# EAGLE design PIC32-RETROBSD_Rev_C (EAGLE 4.16)
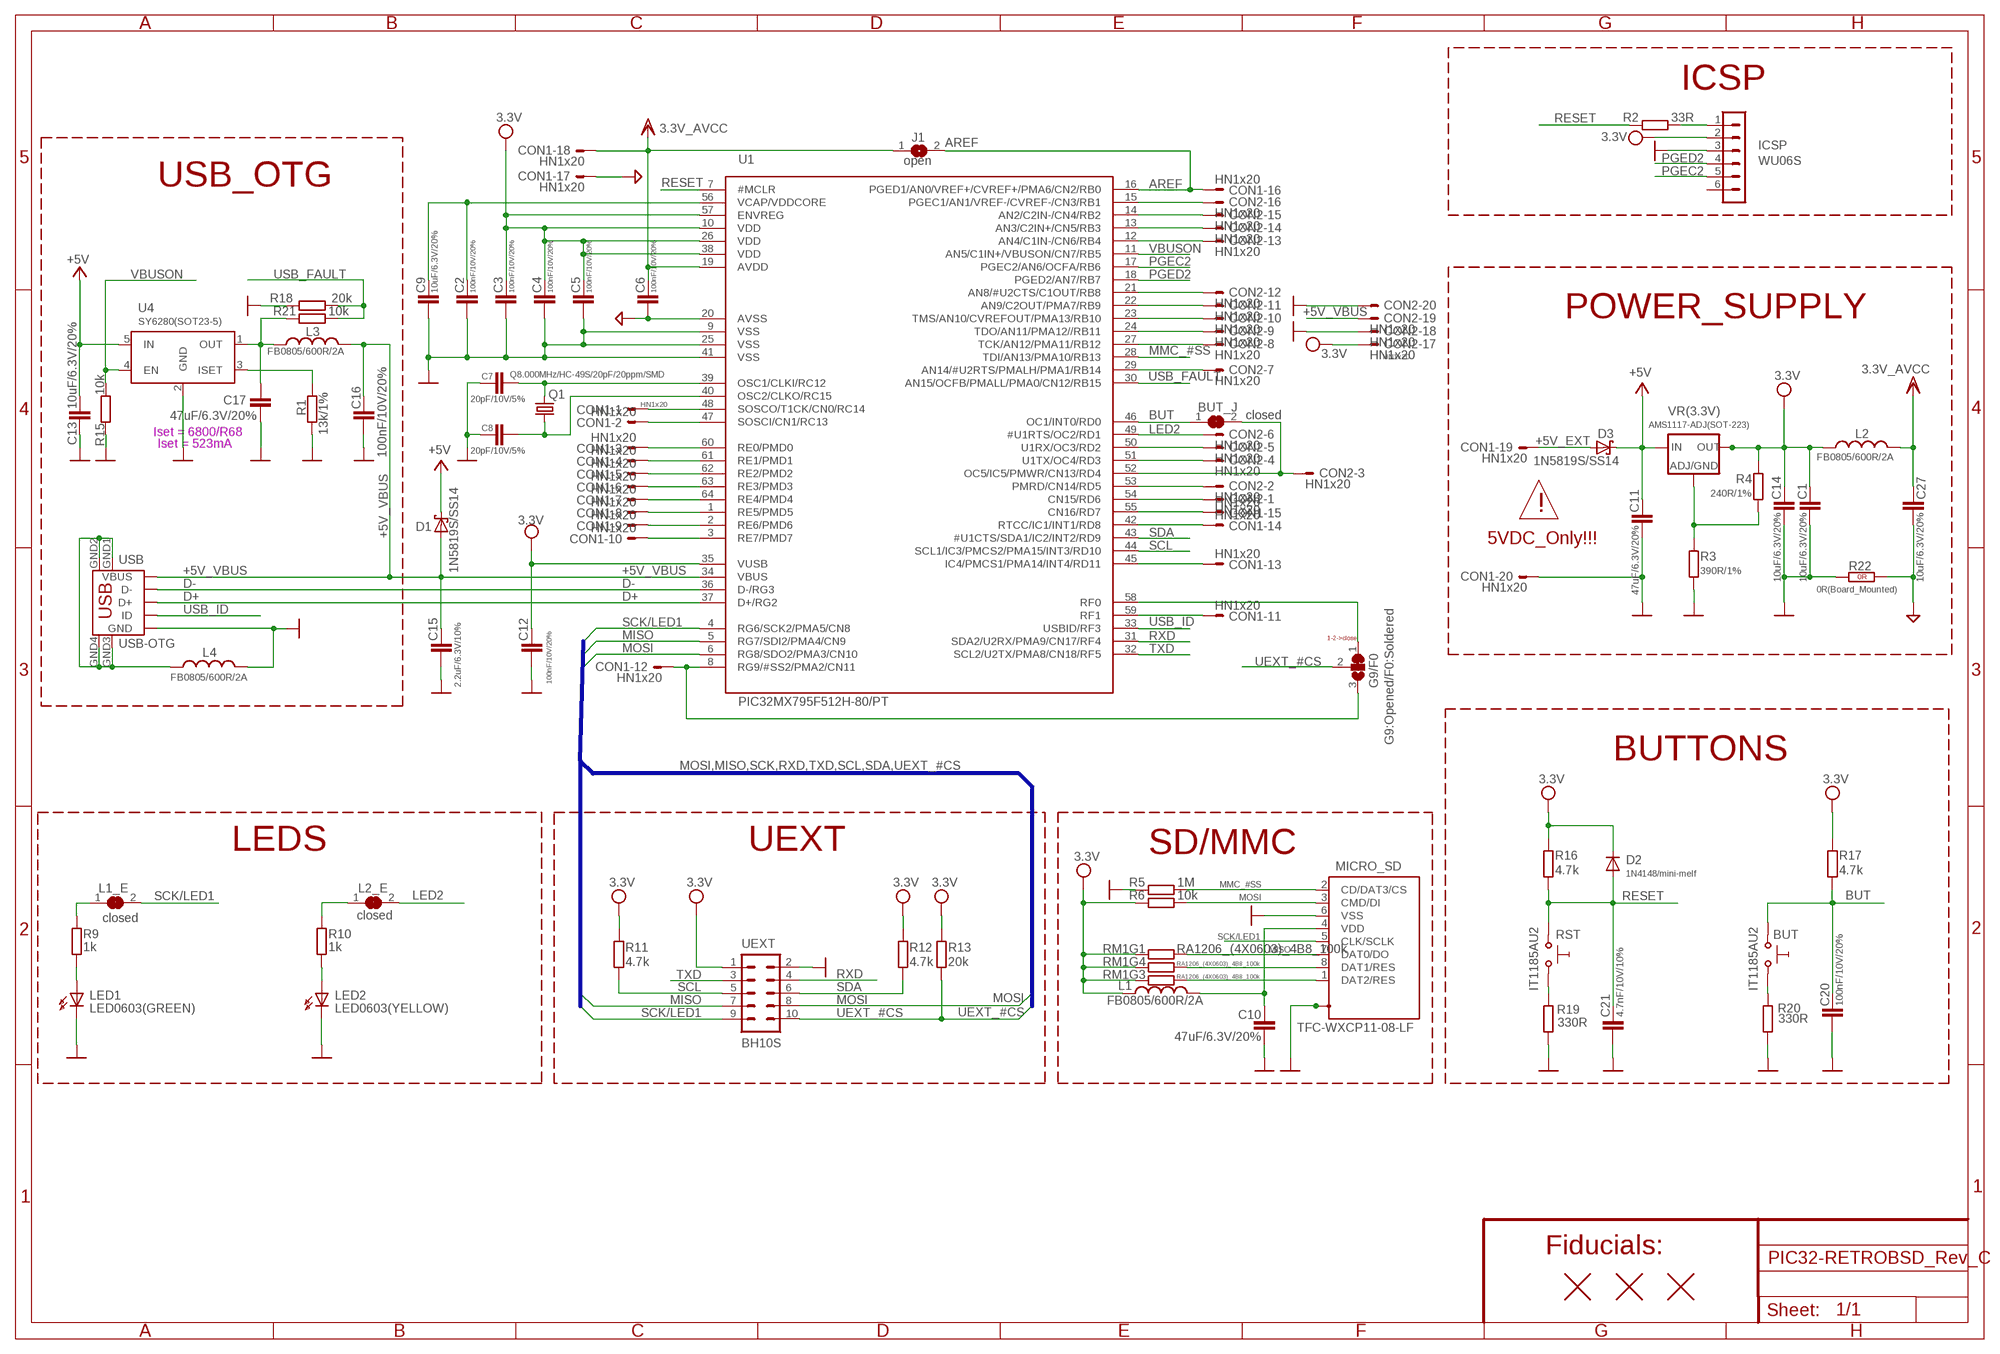
[diagram p0: schematic, sheet 1]

## Parts
BUT  IT1185AU2  SW-TAKTIT1185AU2  [IT1185AU2]
BUT_J  closed  SJSJ_1_SMALLER_CLOSE  [SJ_1_SMALLER_CLOSE]
C1  10uF/6.3V/20%  C-EUC0603_DWS  [C0603_DWS]
C2  100nF/10V/20%  C-EUC0603_DWS  [C0603_DWS]
C3  100nF/10V/20%  C-EUC0603_DWS  [C0603_DWS]
C4  100nF/10V/20%  C-EUC0603_DWS  [C0603_DWS]
C5  100nF/10V/20%  C-EUC0603_DWS  [C0603_DWS]
C6  100nF/10V/20%  C-EUC0603_DWS  [C0603_DWS]
C7  20pF/10V/5%  C-EUC0603_DWS  [C0603_DWS]
C8  20pF/10V/5%  C-EUC0603_DWS  [C0603_DWS]
C9  10uF/6.3V/20%  C-EUC0603_DWS  [C0603_DWS]
C10  47uF/6.3V/20%  C-EUC0805_5MIL_DWS  [C0805_5MIL_DWS]
C11  47uF/6.3V/20%  C-EUC0805_5MIL_DWS  [C0805_5MIL_DWS]
C12  100nF/10V/20%  C-EUC0603_DWS  [C0603_DWS]
C13  10uF/6.3V/20%  C-EUC0603_DWS  [C0603_DWS]
C14  10uF/6.3V/20%  C-EUC0603_DWS  [C0603_DWS]
C15  2.2uF/6.3V/10%  C-EUC0603_DWS  [C0603_DWS]
C16  100nF/10V/20%  C-EUC0603_DWS  [C0603_DWS]
C17  47uF/6.3V/20%  C-EUC0805_5MIL_DWS  [C0805_5MIL_DWS]
C20  100nF/10V/20%  C-EUC0603_DWS  [C0603_DWS]
C21  4.7nF/10V/10%  C-EUC0603_5MIL  [C0603_5MIL]
C27  10uF/6.3V/20%  C-EUC0603_DWS  [C0603_DWS]
CON1  HN1x20  CON20X1_2  [CON20X1]
CON2  HN1x20  CON20X1_2  [CON20X1]
D1  1N5819S/SS14  SCHOTKKY7.62SS2  [MLL-41]
D2  1N4148/mini-melf  DSMD  [MINI-MELF]
D3  1N5819S/SS14  SCHOTKKY7.62SS2  [MLL-41]
G9/F0  G9:Opened/F0:Soldered  SJ2W3  [SJ_2_SMALL]
ICSP  WU06S  CON6WUO6S  [WU06S]
J1  open  SJSJ_SMALLER  [SJ_1_SMALLER]
L1  FB0805/600R/2A  L-USL0805_5MIL_DWS  [L0805_5MIL_DWS]
L1_E  closed  SJSJ_1_SMALLER_CLOSE  [SJ_1_SMALLER_CLOSE]
L2  FB0805/600R/2A  L-USL0805_5MIL_DWS  [L0805_5MIL_DWS]
L2_E  closed  SJSJ_1_SMALLER_CLOSE  [SJ_1_SMALLER_CLOSE]
L3  FB0805/600R/2A  L-USL0805_5MIL_DWS  [L0805_5MIL_DWS]
L4  FB0805/600R/2A  L-USL0805_5MIL_DWS  [L0805_5MIL_DWS]
LED1  LED0603(GREEN)  LED0603DWS  [LED-0603]
LED2  LED0603(YELLOW)  LED0603DWS  [LED-0603]
MICRO_SD  TFC-WXCP11-08-LF  MICRO_SD/MMC_CP_NEW_SMALLERTFC-WXCP11-08-LF  [TFC-WXCP11-08-LF]
Q1  Q8.000MHz/HC-49S/20pF/20ppm/SMD  HC49/S1  [HC49/SMD2_THIN]
R1  13k/1%  R-EU_R0603_5MIL_DWS  [R0603_5MIL_DWS]
R2  33R  R-EU_R0603_5MIL_DWS  [R0603_5MIL_DWS]
R3  390R/1%  R-EU_R0603_5MIL_DWS  [R0603_5MIL_DWS]
R4  240R/1%  R-EU_R0603_5MIL_DWS  [R0603_5MIL_DWS]
R5  1M  R-EU_R0603_5MIL_DWS  [R0603_5MIL_DWS]
R6  10k  R-EU_R0603_5MIL_DWS  [R0603_5MIL_DWS]
R9  1k  R-EU_R0603_5MIL_DWS  [R0603_5MIL_DWS]
R10  1k  R-EU_R0603_5MIL_DWS  [R0603_5MIL_DWS]
R11  4.7k  R-EU_R0603_5MIL_DWS  [R0603_5MIL_DWS]
R12  4.7k  R-EU_R0603_5MIL_DWS  [R0603_5MIL_DWS]
R13  20k  R-EU_R0603_5MIL_DWS  [R0603_5MIL_DWS]
R15  10k  R-EU_R0603_5MIL_DWS  [R0603_5MIL_DWS]
R16  4.7k  R-EU_R0603_5MIL_DWS  [R0603_5MIL_DWS]
R17  4.7k  R-EU_R0603_5MIL_DWS  [R0603_5MIL_DWS]
R18  20k  R-EU_R0603_5MIL_DWS  [R0603_5MIL_DWS]
R19  330R  R-EU_R0603_5MIL_DWS  [R0603_5MIL_DWS]
R20  330R  R-EU_R0603_5MIL_DWS  [R0603_5MIL_DWS]
R21  10k  R-EU_R0603_5MIL_DWS  [R0603_5MIL_DWS]
R22  0R(Board_Mounted)  R_0R0R(NA)  [0603_0R]
RM1  RA1206_(4X0603)_4B8_100k  R_MATRIX_4E  [R_MATRIX_4]
RST  IT1185AU2  SW-TAKTIT1185AU2  [IT1185AU2]
U1  PIC32MX795F512H-80/PT  PIC32MX440F256H"  [LPTQFP64]
U4  SY6280(SOT23-5)  SY6280  [SOT23-5]
U$2  FIDUCIAL  [FIDUCIAL-1X3]
U$3  FIDUCIAL  [FIDUCIAL-1X3]
U$4  FIDUCIAL  [FIDUCIAL-1X3]
UEXT  BH10S  ML10  [ML10-MALE]
USB  USB-OTG  MINI_USB9SMALLER_CREAM  [USB_MINI_9PIN-SMALLER_CREAM]
VR(3.3V)  AMS1117-ADJ(SOT-223)  LM1117THERMAL_OFF  [SOT223_]

## Nets
+5V: C11.1 C13.1 D1.K(C) D3.K(C) U4.5(IN) VR(3.3V).3(IN)
+5V_EXT: CON1.19 D3.A
+5V_VBUS [PWR]: C15.2 C16.1 CON2.19 D1.A L3.1 U1.34(VBUS) USB.VBUS
AGND: C6.2 C27.2 CON1.17 R22.2(1.2) U1.20(AVSS)
AREF: CON1.16 J1.2 U1.16(PGED1/AN0/VREF+/CVREF+/PMA6/CN2/RB0)
BUT: BUT.1 BUT_J.1 C20.1 R17.2 U1.46(OC1/INT0/RD0)
D+: U1.37(D+/RG2) USB.D+
D-: U1.36(D-/RG3) USB.D-
GND [PWR]: C1.2 C2.2 C3.2 C4.2 C5.2 C7.1 C8.1 C9.2 C10.2 C11.2 C12.1 C13.2 C14.2 C15.1 C16.2 C17.2 C20.2 C21.2 CON1.20 CON2.18 CON2.20 ICSP.3 L4.1 LED1.C LED2.C MICRO_SD.6(VSS) MICRO_SD.SH1(PACK1) MICRO_SD.SH2(PACK2) R1.1 R3.1 R5.2 R15.1 R18.1 R19.1 R20.1 R22.1(1.1) U1.9(VSS) U1.25(VSS) U1.41(VSS) U4.2(GND) UEXT.2 USB.GND
LED2: CON2.6 L2_E.2 U1.49(#U1RTS/OC2/RD1)
MCIDAT1: MICRO_SD.8(DAT1/RES) RM1.4.2
MISO: MICRO_SD.7(DAT0/DO) RM1.1.2 U1.5(RG7/SDI2/PMA4/CN9) UEXT.7
MMC_#SS: MICRO_SD.2(CD/DAT3/CS) R5.1 U1.28(TDI/AN13/PMA10/RB13)
MOSI: MICRO_SD.3(CMD/DI) R6.1 U1.6(RG8/SDO2/PMA3/CN10) UEXT.8
N$1: MICRO_SD.1(DAT2/RES) RM1.3.2
N$2: L1_E.1 R9.2
N$3: CON1.1 U1.48(SOSCO/T1CK/CN0/RC14)
N$4: CON1.2 U1.47(SOSCI/CN1/RC13)
N$5: LED2.A R10.1
N$6: CON1.3 U1.60(RE0/PMD0)
N$7: CON1.4 U1.61(RE1/PMD1)
N$8: CON1.5 U1.62(RE2/PMD2)
N$9: CON1.6 U1.63(RE3/PMD3)
N$10: CON1.7 U1.64(RE4/PMD4)
N$11 [PWR]: R19.2 RST.2
N$12 [PWR]: BUT.2 R20.2
N$13: CON1.8 U1.1(RE5/PMD5)
N$14: CON1.9 U1.2(RE6/PMD6)
N$15: CON1.10 U1.3(RE7/PMD7)
N$16: C2.1 C9.1 U1.56(VCAP/VDDCORE)
N$17: C7.2 Q1.2 U1.39(OSC1/CLKI/RC12)
N$18: CON1.11 U1.59(RF1)
N$19: C8.2 Q1.1 U1.40(OSC2/CLKO/RC15)
N$21: CON1.13 U1.45(IC4/PMCS1/PMA14/INT4/RD11)
N$22: CON1.14 U1.42(RTCC/IC1/INT1/RD8)
N$23: LED1.A R9.1
N$24: CON1.15 U1.55(CN16/RD7)
N$25: CON2.1 U1.54(CN15/RD6)
N$26: CON2.2 U1.53(PMRD/CN14/RD5)
N$27: R3.2 R4.1 VR(3.3V).1(ADJ/GND)
N$28: CON2.4 U1.51(U1TX/OC4/RD3)
N$29: CON2.5 U1.50(U1RX/OC3/RD2)
N$30: L2_E.1 R10.2
N$31: CON2.7 U1.29(AN14/#U2RTS/PMALH/PMA1/RB14)
N$32: CON2.8 U1.27(TCK/AN12/PMA11/RB12)
N$33: CON2.9 U1.24(TDO/AN11/PMA12//RB11)
N$34: CON2.10 U1.23(TMS/AN10/CVREFOUT/PMA13/RB10)
N$35: CON2.11 U1.22(AN9/C2OUT/PMA7/RB9)
N$36: CON2.12 U1.21(AN8/#U2CTS/C1OUT/RB8)
N$37: CON2.13 U1.12(AN4/C1IN-/CN6/RB4)
N$38: ICSP.1 R2.2
N$39: CON2.14 U1.13(AN3/C2IN+/CN5/RB3)
N$40: CON2.15 U1.14(AN2/C2IN-/CN4/RB2)
N$41: CON2.16 U1.15(PGEC1/AN1/VREF-/CVREF-/CN3/RB1)
N$42: BUT_J.2 CON2.3 U1.52(OC5/IC5/PMWR/CN13/RD4)
N$44: CON1.12 G9/F0.3 U1.8(RG9/#SS2/PMA2/CN11)
N$45: G9/F0.1 U1.58(RF0)
N$115: R1.2 U4.3(ISET)
N$116: C10.1 L1.2 MICRO_SD.4(VDD)
N$137: C17.1 L3.2 R21.2 U4.1(OUT)
PGEC2: ICSP.5 U1.17(PGEC2/AN6/OCFA/RB6)
PGED2: ICSP.4 U1.18(PGED2/AN7/RB7)
RESET: C21.1 D2.A R2.1 R16.2 RST.1 U1.7(#MCLR)
RXD: U1.31(SDA2/U2RX/PMA9/CN17/RF4) UEXT.4
SCK/LED1: L1_E.2 MICRO_SD.5(CLK/SCLK) U1.4(RG6/SCK2/PMA5/CN8) UEXT.9
SCL: R11.1 U1.44(SCL1/IC3/PMCS2/PMA15/INT3/RD10) UEXT.5
SDA: R12.1 U1.43(#U1CTS/SDA1/IC2/INT2/RD9) UEXT.6
TXD: U1.32(SCL2/U2TX/PMA8/CN18/RF5) UEXT.3
UEXT_#CS: G9/F0.2 R13.1 UEXT.10
USB_FAULT: R18.2 R21.1 U1.30(AN15/OCFB/PMALL/PMA0/CN12/RB15)
USB_ID: U1.33(USBID/RF3) USB.ID
USB_SHIELD: L4.2 USB.GND1 USB.GND2 USB.GND3 USB.GND4
VBUSON: R15.2 U1.11(AN5/C1IN+/VBUSON/CN7/RB5) U4.4(EN)
VCC: C1.1 C3.1 C4.1 C5.1 C12.2 C14.1 CON2.17 D2.C(K) ICSP.2 L1.1 L2.1 R4.2 R6.2 R11.2 R12.2 R13.2 R16.1 R17.1 RM1.1.1 RM1.3.1 RM1.4.1 U1.10(VDD) U1.26(VDD) U1.35(VUSB) U1.38(VDD) U1.57(ENVREG) UEXT.1 VR(3.3V).2(OUT) VR(3.3V).4(RAD) ; supply symbol labelled 3.3V
VDD: C6.1 C27.1 CON1.18 J1.1 L2.2 U1.19(AVDD) ; supply symbol labelled 3.3V_AVCC
Unconnected: ICSP.6 RM1.2.1 RM1.2.2

## Buses
MOSI,MISO,SCK,RXD,TXD,SCL,SDA,UEXT_#CS

## Notes on the sheet
- ICSP
- USB_OTG
- POWER_SUPPLY
- Iset = 6800/R68
- Iset = 523mA
- !
- 5VDC_Only!!!
- 1-2->close
- BUTTONS
- LEDS | UEXT | SD/MMC
- Fiducials:

## Library data of the parts
BUT RST = gogo:SW-TAKT
BUT_J J1 L1_E L2_E = jumper:SJ: SMD solder JUMPER
C1-C17 C20 C21 C27 = rcl:C-EU: CAPACITOR, European symbol
CON1 CON2 = gogo:CON20X1_2
D1 D3 = gogo:SCHOTKKY7.62SS
D2 = DOUBLE-SIDE:D: DIODES
G9/F0 = jumper:SJ2W: SMD solder JUMPER
ICSP = Penko:CON6: CONNECTORS - 6 PINS
L1-L4 = rcl:L-US: INDUCTOR, American symbol
LED1 LED2 = DOUBLE-SIDE:LED
MICRO_SD = OLIMEX_CONNECTORS:MICRO_SD/MMC_CP_NEW_SMALLER
Q1 = crystal:HC49/S: CRYSTAL
R1-R6 R9-R13 R15-R21 = rcl:R-EU_: RESISTOR, European symbol
R22 = OLIMEX_DISCRET:R_0R
RM1 = OLIMEX_DISCRET:R_MATRIX_4E
U1 = OLIMEX_IC:PIC32MX440F256H: USB Microcontroller MIPS32® M4K® 32-bit core with 5-stage pipeline 80 MHz maximum frequency 1.56 DMIPS/MHz (Dhrystone 2.1) performance at wait state Flash access Single-cycle multiply and high-performance divide unit MIPS16e® mode for up to 40% smaller code size Two sets of 32 core register files (32-bit) to reduce interrupt latency Prefetch Cache module to speed execution from Flash
U4 = OLIMEX_IC:SY6280
U$2-U$4 = SparkFunEagle-6-6-07:FIDUCIAL: Fiducial Alignment Points Various fiducial points for machine vision alignment.
UEXT = con-harting-ml:ML10: HARTING
USB = OLIMEX_CONNECTORS:MINI_USB9
VR(3.3V) = arm:LM1117

## Net classes
1 PWR: width 0.203 mm, drill 0.178 mm, clearance 0.381 mm

## Board
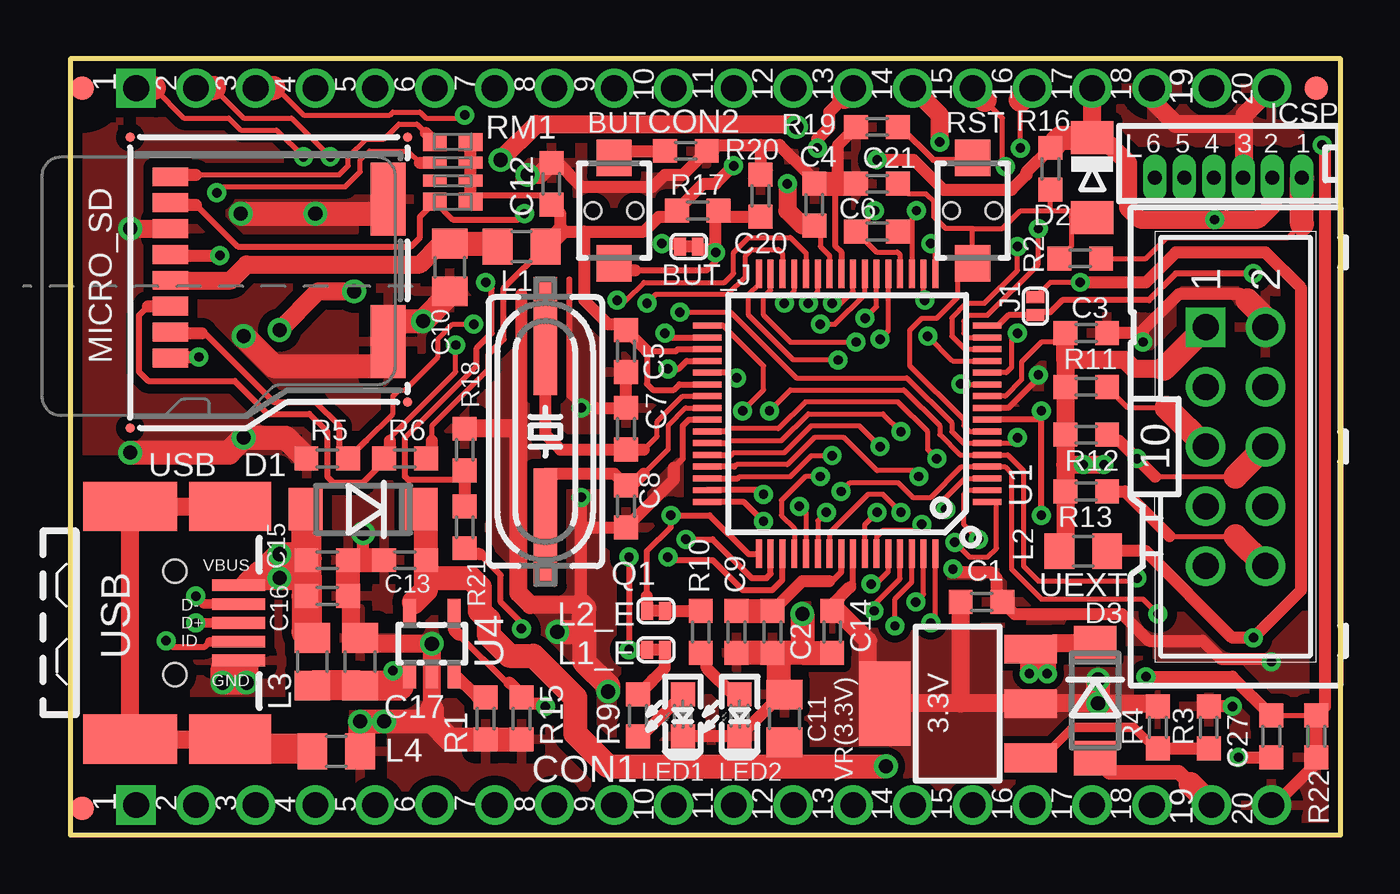
[diagram p1: board, top side]
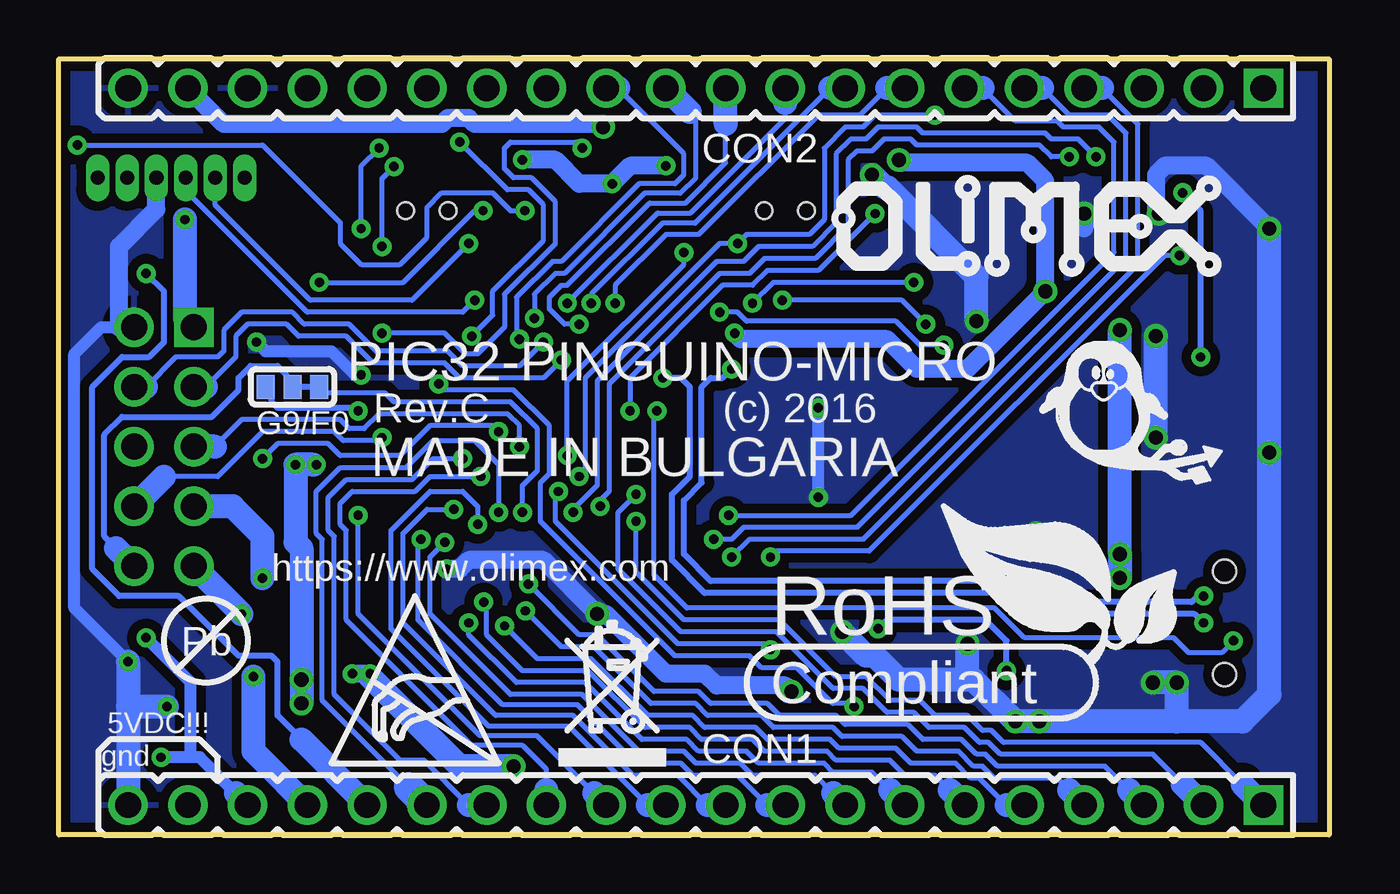
[diagram p2: board, bottom side, seen from below]

Size 54 x 33 mm. Coordinates in mm from the lower left corner, seen from the top.
Outline: 0,0 54,0 54,33 0,33 0,0
Copper layers (1+16): Top 0.035mm / dielectric 1.5mm / Bottom 0.035mm
Design rules "default": minimum track width 8mil, minimum drill 0.4mm, track to track 8mil, track to pad 8mil, pad to pad 8mil, via to via 8mil, smd to smd 1mil, copper to edge 10mil, drill to drill 8mil, minimum pad ring 8mil, minimum via ring 8mil, stop-mask expansion 4mil, vias tented up to drill 25mil, thermal gap 20mil
tRestrict: 3 lines

### Footprints (pad centres in the part's own frame; a part is rotated, then mirrored left to right if it is on the bottom)
IT1185AU2 = smd 1.55 x 1.5: 1 -2.25,0; 2 2.25,0 | hole 0.7: 0,-0.9; 0,0.9
SJ_1_SMALLER_CLOSE = smd 0.508 x 0.762: 1 -0.381,0; 2 0.381,0
C0603_DWS = smd 1.016 x 1.016: 1 -0.889,0; 2 0.889,0
C0805_5MIL_DWS = smd 1.27 x 1.524: 1 -1.016,0; 2 1.016,0
C0603_5MIL = smd 1.016 x 1.016: 1 -0.889,0; 2 0.889,0
CON20X1 = drill 1.092 pad 1.676 square: 1 -24.13,0 | drill 1.092 pad 1.676 round: 2 -21.59,0; 3 -19.05,0; 4 -16.51,0; 5 -13.97,0; 6 -11.43,0; 7 -8.89,0; 8 -6.35,0; 9 -3.81,0; 10 -1.27,0; 11 1.27,0; 12 3.81,0; 13 6.35,0; 14 8.89,0; 15 11.43,0; 16 13.97,0; 17 16.51,0; 18 19.05,0; 19 21.59,0; 20 24.13,0
MLL-41 = smd 1.45 x 1.8: A 2.445,0; K -2.445,0
MINI-MELF = smd 1.4 x 1.8: A 1.7,0; C -1.7,0
SJ_2_SMALL = smd 0.762 x 1.016: 1 -1.143,0; 2 0,0; 3 1.143,0
WU06S = drill 0.6 pad 0.991 long: 1 -3.125,0; 2 -1.875,0; 3 -0.625,0; 4 0.625,0; 5 1.875,0; 6 3.125,0
SJ_1_SMALLER = smd 0.508 x 0.762: 1 -0.381,0; 2 0.381,0
L0805_5MIL_DWS = smd 1.27 x 1.524: 1 -1.016,0; 2 1.016,0
LED-0603 = smd 1.016 x 1.016: A 0.889,0; C -0.889,0
TFC-WXCP11-08-LF = smd 1.5 x 0.8: 1 4,3.85; 2 4,2.75; 3 4,1.65; 4 4,0.55; 5 4,-0.55; 6 4,-1.65; 7 4,-2.75; 8 4,-3.85 | smd 0.4 x 0.4: FID1 5.72,6.82; FID2 -6.08,5.73; FID3 -6.08,-5.54; FID4 5.72,-5.54 | smd 1.5 x 3.1: SH1 -5.25,-2.91; SH2 -5.25,3.15
HC49/SMD2_THIN = smd 5 x 1: 1 -4.064,0; 2 4.064,0
R0603_5MIL_DWS = smd 1.016 x 1.016: 1 -0.889,0; 2 0.889,0
0603_0R = smd 1.016 x 1.016: 1 -0.889,0; 2 0.889,0
R_MATRIX_4 = smd 0.762 x 1.016: 1.1 -1.27,-0.762; 1.2 -1.27,0.762; 4.1 1.27,-0.762; 4.2 1.27,0.762 | smd 0.508 x 1.016: 2.1 -0.381,-0.762; 2.2 -0.381,0.762; 3.1 0.381,-0.762; 3.2 0.381,0.762
LPTQFP64 = smd 0.254 x 1.2: 1 -3.75,-5.95; 2 -3.25,-5.95; 3 -2.75,-5.95; 4 -2.25,-5.95; 5 -1.75,-5.95; 6 -1.25,-5.95; 7 -0.75,-5.95; 8 -0.25,-5.95; 9 0.25,-5.95; 10 0.75,-5.95; 11 1.25,-5.95; 12 1.75,-5.95; 13 2.25,-5.95; 14 2.75,-5.95; 15 3.25,-5.95; 16 3.75,-5.95; 33 3.75,5.95; 34 3.25,5.95; 35 2.75,5.95; 36 2.25,5.95; 37 1.75,5.95; 38 1.25,5.95; 39 0.75,5.95; 40 0.25,5.95; 41 -0.25,5.95; 42 -0.75,5.95; 43 -1.25,5.95; 44 -1.75,5.95; 45 -2.25,5.95; 46 -2.75,5.95; 47 -3.25,5.95; 48 -3.75,5.95 | smd 1.2 x 0.254: 17 5.95,-3.75; 18 5.95,-3.25; 19 5.95,-2.75; 20 5.95,-2.25; 21 5.95,-1.75; 22 5.95,-1.25; 23 5.95,-0.75; 24 5.95,-0.25; 25 5.95,0.25; 26 5.95,0.75; 27 5.95,1.25; 28 5.95,1.75; 29 5.95,2.25; 30 5.95,2.75; 31 5.95,3.25; 32 5.95,3.75; 49 -5.95,3.75; 50 -5.95,3.25; 51 -5.95,2.75; 52 -5.95,2.25; 53 -5.95,1.75; 54 -5.95,1.25; 55 -5.95,0.75; 56 -5.95,0.25; 57 -5.95,-0.25; 58 -5.95,-0.75; 59 -5.95,-1.25; 60 -5.95,-1.75; 61 -5.95,-2.25; 62 -5.95,-2.75; 63 -5.95,-3.25; 64 -5.95,-3.75
SOT23-5 = smd 1.2 x 0.55: 1 1.3,-0.95; 2 1.3,0; 3 1.3,0.95; 4 -1.3,0.95; 5 -1.3,-0.95
FIDUCIAL-1X3 = smd 1 x 1: 1 0,0
ML10-MALE = drill 1.1 pad 1.676 square: 1 -5.08,-1.27 | drill 1.1 pad 1.676 round: 2 -5.08,1.27; 3 -2.54,-1.27; 4 -2.54,1.27; 5 0,-1.27; 6 0,1.27; 7 2.54,-1.27; 8 2.54,1.27; 9 5.08,-1.27; 10 5.08,1.27
USB_MINI_9PIN-SMALLER_CREAM = smd 2.25 x 0.5: D+ -3.722,0; D- -3.722,-0.8; GND -3.722,1.6; ID -3.722,0.8; VBUS -3.722,-1.6 | smd 4 x 2.1: GND1 0.884,-4.95; GND3 0.884,4.95 | smd 3.5 x 2.1: GND2 -3.366,-4.95; GND4 -3.366,4.95 | hole 1: -1.016,-2.2; -1.016,2.2
SOT223_ = smd 1.219 x 2.235: 1 -2.311,-3.099; 2 0,-3.099; 3 2.311,-3.099 | smd 3.6 x 2.2: 4 0,3.099

### Placement (x,y rotation side)
BUT  23.11,26.54 90 top
BUT_J  26.29,25.02 180 top
C1  38.73,9.91 0 top
C2  29.84,8.64 270 top
C3  43.18,21.34 0 top
C4  31.62,26.8 90 top
C5  23.62,20.57 270 top
C6  34.29,25.65 180 top
C7  23.62,17.27 270 top
C8  23.62,13.97 90 top
C9  28.32,8.64 270 top
C10  16.13,24.13 270 top
C11  30.35,4.95 90 top
C12  20.45,27.69 270 top
C13  14.22,11.68 180 top
C14  32.38,8.64 270 top
C15  10.92,11.68 180 top
C16  10.92,10.16 0 top
C17  12.32,7.37 90 top
C20  29.34,27.18 90 top
C21  34.29,27.69 180 top
C27  51.05,4.19 90 top
CON1  26.92,1.27 180 bottom
CON2  26.92,31.75 180 bottom
D1  12.45,13.84 180 top
D2  43.43,27.94 270 top
D3  43.56,5.71 270 top
G9/F0  44.07,19.05 180 bottom
ICSP  49.23,27.94 180 top
J1  41.02,22.48 270 top
L1  19.18,25.02 180 top
L1_E  24.89,7.87 180 top
L2  43.05,12.06 0 top
L2_E  24.89,9.53 180 top
L3  10.29,7.37 270 top
L4  11.3,3.56 180 top
LED1  26.04,5.08 90 top
LED2  28.45,5.08 90 top
MICRO_SD  8.26,24.13 180 top
Q1  20.19,17.14 90 top
R1  17.65,4.95 90 top
R2  42.93,24.51 0 top
R3  48.39,4.57 270 top
R4  46.23,4.57 90 top
R5  10.92,16 180 top
R6  14.22,16 0 top
R9  24.13,5.08 90 top
R10  26.8,8.64 90 top
R11  43.18,19.05 180 top
R12  43.18,17.02 180 top
R13  43.18,14.61 180 top
R15  19.18,4.95 90 top
R16  41.66,28.32 270 top
R17  26.67,26.54 0 top
R18  16.76,16.38 270 top
R19  34.29,30.1 0 top
R20  26.16,29.08 180 top
R21  16.76,13.08 270 top
R22  52.96,4.19 90 top
RM1  16.26,28.19 90 top
RST  38.35,26.54 90 top
U1  33.02,17.91 90 top
U4  15.37,8.13 270 top
U$1  [PB_SMALL]  47.75,8.26 0 bottom
U$2  0.51,31.75 90 top
U$3  52.96,31.75 90 top
U$4  0.51,1.14 90 top
U$8  [RECYCLE_BIN1/8]  32.77,2.92 0 bottom
U$9  [PENGUIN_8X6MM_RIGHT]  9.53,17.65 0 bottom
U$11  [OLIMEX1_V]  3.43,23.62 0 bottom
U$13  [ESD_SYMBOL]  42.42,3.05 0 bottom
U$14  [ROHS]  23.75,5.59 0 bottom
UEXT  49.53,16.51 270 top
USB  3.43,9.02 180 top
VR(3.3V)  37.72,5.59 90 top

### Tracks (layer width: path | path; a pad name or v marks a point on that pad's centre or on a via)
+5V  (via drill 0.4, 0.6)
  Top 0.508: U4.5 14.42,9.72 14.61,9.91
  Top 0.762: D3.K 41.81,8.16 41.53,7.87 | 41.53,7.87 41.55,7.9 VR(3.3V).3 40.77,7.85 v40.77,6.86 | v41.53,6.86 41.53,7.87
  Top 1.016: 15.11,10.92 17.02,10.92 17.4,10.54 17.4,9.53 17.78,9.14 17.78,8.51 18.67,7.62 19.68,7.62 21.46,5.84 21.46,4.32 22.86,2.92 30.35,2.92 | 15.11,10.92 15.11,10.41 14.61,9.91 | 15.11,10.92 C13.1 15.11,13.62 D1.K | 30.35,2.92 C11.1 | 30.35,2.92 v34.67,2.92
  Bottom 0.762: v41.53,6.86 v40.77,6.86 40.77,6.73
  Bottom 1.016: v34.67,2.92 36.96,2.92 40.77,6.73
+5V_EXT
  Top 0.61: D3.A 44.16,2.67 47.12,2.67 47.62,2.16
  Top 1.016: 47.62,2.16 CON1.19
+5V_VBUS  (via drill 0.4, 0.6)
  Top 0.254: v25.27,21.34 25.45,21.16 U1.34
  Top 0.508: USB.VBUS 7.58,11.05 8,11.05 8.13,11.05
  Top 0.762: v18.29,28.7 19.81,30.23 30.73,30.23 v30.86,30.1 | v8.89,10.92 8.89,11.05 | v8.89,21.46 10.54,23.11 v12.06,23.11
  Top 1.016: v8.89,11.94 v8.89,10.92 | 10.03,11.81 10.03,11.94 v8.89,11.94 | 8,11.05 v8.89,11.94
  Top 1.27: L3.1 10.03,8.64 C16.1 10.03,11.05 | 10.03,11.05 C15.2 10.03,11.81 10.03,13.81 D1.A | 8.13,11.05 8.89,11.05 10.03,11.05
  Bottom 0.762: v30.86,30.1 30.99,30.23 36.32,30.23 36.58,30.48 37.47,30.48 37.72,30.23 46.99,30.23 CON2.19 | v18.29,28.7 18.16,28.57 12.83,28.57 12.06,27.81 v12.06,23.11 15.37,19.81 17.53,19.81 18.8,21.08 25.02,21.08 v25.27,21.34
  Bottom 1.016: v8.89,10.92 v8.89,11.94 v8.89,21.46
AGND  (via drill 0.4)
  Top 0.203: C27.2 R22.2 | U1.20 35.27,24.67 35.15,24.79 34.27,24.79 C6.2 34.19,26.44 v34.19,26.54
  Top 0.508: C27.2 49.4,6.73 v45.72,6.73 | R22.2 53.34,5.46 53.34,29.21 v53.21,29.34
  Bottom 0.203: v53.21,29.34 45.34,29.34 42.04,26.04 42.04,25.15 41.15,24.26 39.5,24.26 38.35,25.4 38.35,26.67 37.72,27.3 35.56,27.3 34.8,26.54 v34.19,26.54
  Bottom 1.016: CON1.17 45.34,3.17 45.72,3.56 45.72,4.83 v45.72,6.73
AREF  (via drill 0.4)
  Top 0.254: U1.16 39.44,21.66 39.88,22.1 J1.2 41.15,22.23 41.66,22.23 42.16,22.73 45.85,22.73 46.99,23.88 v50.29,23.88
  Bottom 0.254: 43.69,4.06 44.7,5.08 44.7,7.37 44.96,7.62 46.35,7.62 48.9,10.16 51.44,10.16 52.58,11.3 52.58,19.05 51.31,20.32 50.16,20.32 49.53,20.95 49.53,23.11 v50.29,23.88
  Bottom 1.016: CON1.16 43.69,4.06
BUT  (via drill 0.4)
  Top 0.203: 28.36,15.16 28.45,15.24 30.61,15.24 31.5,16.13 v32.38,16.13
  Top 0.254: U1.46 28.36,15.16 | 24,24 27.05,24 27.43,24.38 v27.43,24.77
  Top 0.508: v27.43,24.77 27.43,24.89 | 27.43,24.89 26.67,24.89 BUT_J.1 | BUT.1 23.4,24 24,24 | 27.43,24.89 27.43,26.29 27.56,26.29 | 27.56,26.29 R17.2 | 27.56,26.29 C20.1
  Bottom 0.203: v32.38,16.13 32.38,19.3 27.43,24.26 v27.43,24.77
D+  (via drill 0.4)
  Top 0.254: v28.32,19.43 28.09,19.66 U1.37
  Top 0.406: USB.D+ v5.33,9.02
  Bottom 0.254: v5.33,9.02 5.71,9.4 12.45,9.4 13.34,10.29 26.54,10.29 27.94,11.68 27.94,14.48 27.18,15.24 27.18,19.05 27.56,19.43 v28.32,19.43
D-  (via drill 0.4)
  Top 0.254: v25.4,19.81 25.85,19.81 26.2,20.16 U1.36
  Top 0.406: USB.D- 5.68,9.82 v5.33,10.16
  Bottom 0.254: v25.4,19.81 25.78,19.43 26.29,19.43 26.67,19.05 26.67,14.99 27.43,14.22 27.43,11.94 26.29,10.79 13.08,10.79 12.19,9.91 5.84,9.91 5.59,10.16 v5.33,10.16
GND  (via drill 0.4, 0.6)
  Top 0.254: U1.25 32.77,24.79 32.51,25.04 32.51,27.69 | U1.9 39.87,18.16 41.15,19.43 v41.15,19.56 | U1.41 26.29,17.66 26.04,17.4 26.04,16 25.65,15.62 | v21.72,18.16 21.21,18.67 21.21,23.62
  Top 0.508: CON1.20 51.18,1.27 52.96,3.05 R22.1 | LED1.C LED2.C 30.1,5.84 30.1,5.97 | C5.2 C7.1 v21.72,18.16 | R19.1 32.64,29.34 32.64,27.69 32.51,27.69 | 21.72,13.08 C8.1 25.65,15.11 25.65,15.62 | 50.04,22.73 49.78,22.99 47.12,22.99 45.59,21.46 45.59,21.34 | C4.2 31.37,27.94 31.37,28.12 30.15,29.34 29.34,29.34 | 29.34,29.34 27.3,29.34 R20.1 26.04,28.07 25.27,28.07 24.77,27.56 21.72,27.56 20.7,28.57 C12.1 | 29.34,29.34 C20.2 | v51.05,7.37 50.93,7.49 48.9,7.49 48.13,8.26 45.85,8.26 44.7,9.4 40.13,9.4 C1.2 39.37,10.16 39.37,10.92 39.12,11.18 37.64,11.18 v37.52,11.3 | 45.59,21.34 v45.59,20.95 | 45.59,21.34 C3.2 | v49.4,5.46 R3.1 | 21.72,9.78 21.72,13.08 | 21.72,13.08 v21.72,14.35 | 6.48,7.11 6.78,7.42 USB.GND 7.49,7.08 | 18.92,17.27 19.18,17.27 19.18,22.99 | 12.45,11.68 v12.45,12.83
  Top 0.762: CON2.18 45.97,31.24 46.99,30.23 49.91,30.23 | 49.91,30.23 49.91,30.61 CON2.20 | ICSP.3 49.91,28 49.91,30.23 | 21.72,9.78 19.56,9.78 19.05,10.29 19.05,17.27 18.92,17.27 R18.1 | C16.2 11.94,10.16 11.94,8.76 C17.2 12.32,8.13 v15.37,8.13 U4.2 15.37,5.33 | MICRO_SD.6 v2.54,25.78 | C12.1 19.94,28.07 v19.43,28.07
  Top 1.016: 50.04,22.73 50.8,21.97 UEXT.2 | C4.2 32.51,27.69 | 32.64,27.69 C21.2 | 31.11,7.75 C14.2 | L4.1 v12.32,4.83 v13.34,4.83 15.37,4.83 | C16.2 C15.1 12.45,11.68 C13.2 | 15.37,4.83 15.37,5.33 | v31.11,9.4 31.11,7.75 | 31.11,7.75 C2.2 | C2.2 C9.2 | C2.2 30.1,7.75 30.1,5.97 C11.2 | v22.86,6.1 22.86,6.35 21.84,7.37 21.84,8.64 | 21.84,8.64 21.84,9.65 21.72,9.78 | v20.7,8.64 21.84,8.64 | R15.1 R1.1 16.13,4.06 15.37,4.83 | 6.48,7.11 v6.48,6.48 v7.49,6.48 7.49,7.08 | R5.2 9.14,16.89 v7.37,16.89 6.73,16.26 v2.54,16.26 | C10.2 16.13,22.99 v14.99,21.84 14.1,21.84 13.51,21.25 MICRO_SD.SH2 13.51,19.94 8.64,19.94 v7.37,21.21 | MICRO_SD.SH1 13.51,26.42 v10.41,26.42 v7.24,26.42
  Bottom 0.508: v45.59,20.95 45.21,20.57 42.42,20.57 41.4,19.56 v41.15,19.56 | 51.44,21.59 52.2,21.59 53.34,20.45 53.34,9.65 v51.05,7.37 | 37.47,11.3 v37.52,11.3 | v21.72,14.35 v21.72,18.16
  Bottom 0.762: ICSP.3 49.85,26.6 51.44,25.02 51.44,21.59 UEXT.2 | 37.47,11.3 36.96,11.3 36.58,11.68 33.4,11.68 v31.11,9.4 30.73,9.4 28.19,6.86 26.54,6.86 26.04,6.35 23.11,6.35 v22.86,6.1 | v7.24,26.42 7.37,26.42 7.37,28.07 6.99,28.45 5.21,28.45 v2.54,25.78 | v10.41,26.42 10.41,25.78
  Bottom 1.016: 6.48,4.83 v12.32,4.83 v13.34,4.83 15.11,6.6 15.37,6.6 | 6.48,4.83 v6.48,6.48 v7.49,6.48 | 6.48,4.83 3.68,4.83 2.54,5.97 v2.54,16.26 v2.54,25.78 | v51.05,7.37 51.05,5.46 | 51.05,5.46 CON1.20 | 51.05,5.46 v49.4,5.46 | v20.7,8.64 19.68,7.62 19.3,7.62 18.29,6.6 15.37,6.6 | 15.37,6.6 v15.37,8.13 | v14.99,21.84 14.99,23.75 18.77,27.53 18.9,27.53 v19.43,28.07 | v7.37,16.89 v7.37,21.21
  pour Bottom (isolate 0.406, rank 2): 58.42,38.1 -5.08,38.1 -5.08,-5.08 58.42,-5.08
  pour Top (isolate 0.406, rank 2): 55.88,35.56 -2.54,35.56 -2.54,-2.54 55.88,-2.54
LED2  (via drill 0.4)
  Top 0.254: U1.49 29.25,11.94 28.83,11.94 27.18,13.59 v25.53,13.59 25.53,13.08 24.51,12.06 24.51,10.16
  Top 0.508: L2_E.2 24.51,10.16
  Bottom 0.203: v25.53,13.59 20.32,13.59 9.14,24.77 9.14,29.46 9.78,30.1 11.3,30.1 11.56,30.35 13.34,30.35 14.73,31.75
  Bottom 1.016: 14.73,31.75 CON2.6
MCIDAT1
  Top 0.203: 15.11,29.84 14.73,30.23 13.97,30.23 13.34,29.59 12.57,29.59 11.81,28.83 11.81,28.45 11.43,28.07 5.33,28.07
  Top 0.508: 15.11,29.84 RM1.4.2 | MICRO_SD.8 4.34,28.07 5.33,28.07
MISO  (via drill 0.4)
  Top 0.203: v45.34,10.92 45.21,10.79 41.15,10.79 40.51,11.43 40.51,15.49 39.85,16.16 U1.5 37.82,16.16 36.96,17.02 36.96,17.4 35.43,18.92 30.61,18.92 v29.72,18.03
  Top 0.254: v19.3,26.42 19.05,26.16 16.26,26.16 RM1.1.2 14.86,26.29 14.86,25.4 14.48,25.02 7.11,25.02 5.33,26.8
  Top 0.508: MICRO_SD.7 4.25,26.8 5.33,26.8
  Bottom 0.203: v29.72,18.03 29.72,19.43 25.78,23.37 24.51,23.37 23.88,24 21.72,24 v19.3,26.42
  Bottom 1.016: v45.34,10.92 45.34,12.7 46.61,13.97 UEXT.7
MMC_#SS  (via drill 0.4)
  Top 0.203: U1.28 31.27,24.74 30.61,25.4 28.83,25.4 28.19,24.77 28.19,23.88 27.81,23.5 24.38,23.5 23.62,22.73 v23.24,22.73 | 12.57,16.76 13.72,17.91 13.72,18.67 13.97,18.92 14.22,18.92 15.62,20.32 15.62,21.08 16.26,21.72 v17.14,21.72
  Top 0.254: 12.57,16.76 R5.1 11.43,16.38 11.43,17.4 10.41,18.41 8.64,18.41 5.71,21.34 5.59,21.34
  Top 0.508: MICRO_SD.2 4.3,21.34 5.59,21.34
  Bottom 0.203: v17.14,21.72 18.16,22.73 v23.24,22.73
MOSI  (via drill 0.4)
  Top 0.203: v40.26,16.89 40.26,16.76 40.15,16.66 U1.6 37.95,16.66 37.47,17.14 37.47,17.53 35.56,19.43 30.86,19.43 28.07,22.23 v25.91,22.23 | 13.59,16.76 13.59,16.89 16.38,19.68 v16.38,20.83
  Top 0.254: 3.3,22.48 2.92,22.1 2.92,19.68 3.3,19.3 6.99,19.3 8.38,17.91 10.16,17.91 10.92,17.14 10.92,15.24 11.18,14.99 12.45,14.99 13.34,15.88 R6.1
  Top 0.508: R6.1 13.59,16.26 13.59,16.76 | 3.3,22.48 MICRO_SD.3
  Bottom 0.203: v40.26,16.89 40.39,16.76 41.91,16.76 42.29,17.14 45.34,17.14 47.24,15.24 49.53,15.24 | v16.38,20.83 17.4,20.83 18.41,21.84 24.77,21.84 25.15,22.23 v25.91,22.23
  Bottom 1.016: 49.53,15.24 UEXT.8
N$1  (via drill 0.4)
  Top 0.203: 14.86,28.57 14.35,29.08 12.7,29.08 12.32,28.7 12.32,28.19 11.68,27.56 6.48,27.56 v6.22,27.3
  Top 0.508: 14.86,28.57 RM1.3.2 | MICRO_SD.1 4.29,20.32 v5.46,20.32
  Bottom 0.254: v5.46,20.32 5.46,26.54 v6.22,27.3
N$2
  Top 0.508: L1_E.1 25.27,7.11 24.77,6.6 R9.2
N$3  (via drill 0.4)
  Top 0.254: v29.46,13.34 28.64,14.16 U1.48
  Bottom 0.203: v29.46,13.34 29.46,11.18 27.43,9.14 23.37,9.14 20.95,6.73 19.68,6.73 18.67,5.71 17.4,5.71 16.76,5.08 15.37,5.08 14.73,4.45 14.35,4.45 13.84,3.94 5.46,3.94 3.68,2.16
  Bottom 1.016: CON1.1 3.68,2.16
N$4  (via drill 0.4)
  Top 0.254: U1.47 29.29,14.66 v29.46,14.48
  Bottom 0.203: 6.22,2.16 7.49,3.43 13.97,3.43 14.48,3.94 14.86,3.94 15.49,4.57 17.02,4.57 17.65,5.21 18.8,5.21 19.81,6.22 21.08,6.22 23.5,8.64 27.56,8.64 30.23,11.3 30.23,13.72 v29.46,14.48
  Bottom 1.016: CON1.2 6.22,2.16
N$5
  Top 0.508: R10.1 27.05,7.49 27.05,7.11 28.19,5.97 LED2.A
N$6  (via drill 0.4)
  Top 0.203: v34.04,10.67 34.23,10.67 34.77,11.2 U1.60
  Bottom 0.203: 8.51,1.91 9.53,2.92 14.1,2.92 14.61,3.43 14.99,3.43 15.62,4.06 17.27,4.06 17.91,4.7 20.57,4.7 20.95,5.08 23.37,5.08 23.88,5.59 26.29,5.59 26.8,6.1 28.7,6.1 31.11,8.51 31.88,8.51 v34.04,10.67
  Bottom 1.016: CON1.3 8.51,1.91
N$7  (via drill 0.4)
  Top 0.203: v34.16,9.53 34.16,9.78 35.27,10.89 U1.61
  Bottom 0.203: v34.16,9.53 32.64,8 31.24,8 28.83,5.59 26.92,5.59 26.42,5.08 24.13,5.08 23.62,4.57 21.08,4.57 20.7,4.19 18.16,4.19 17.53,3.56 15.75,3.56 15.11,2.92 14.73,2.92 14.22,2.41 11.56,2.41 11.05,1.91
  Bottom 1.016: CON1.4 11.05,1.91
N$8  (via drill 0.4)
  Top 0.203: U1.62 35.77,10.75 35.05,10.03 v35.05,8.89
  Bottom 0.203: v35.05,8.89 33.66,7.49 31.37,7.49 28.96,5.08 27.05,5.08 26.54,4.57 24.38,4.57 23.88,4.06 21.21,4.06 20.83,3.68 18.41,3.68 17.78,3.05 15.88,3.05 15.24,2.41 14.86,2.41 13.72,1.27
  Bottom 1.016: CON1.5 13.72,1.27
N$9  (via drill 0.4)
  Top 0.203: v35.94,9.91 36.27,10.23 U1.63
  Bottom 0.203: v35.94,9.91 35.81,9.78 35.81,8.51 34.29,6.99 31.5,6.99 29.08,4.57 27.18,4.57 26.67,4.06 24.51,4.06 24,3.56 21.34,3.56 20.95,3.17 18.67,3.17 18.03,2.54 16.76,2.54 16.13,1.91
  Bottom 1.016: CON1.6 16.13,1.91
N$10  (via drill 0.4)
  Top 0.203: v36.58,9.02 36.77,9.21 U1.64
  Bottom 0.203: v36.58,9.02 36.58,8.51 34.54,6.48 31.62,6.48 29.21,4.06 27.3,4.06 26.8,3.56 24.77,3.56 24.26,3.05 21.46,3.05 21.08,2.67 19.43,2.67 18.67,1.91
  Bottom 1.016: CON1.7 18.67,1.91
N$11
  Top 0.254: RST.2 38.26,28.7 36.68,28.7 35.28,30.1 R19.2
N$12
  Top 0.508: BUT.2 23.4,29.08 R20.2
N$13  (via drill 0.4)
  Top 0.203: v37.59,12.45 38.23,11.81 38.99,11.81 39.37,12.19 39.37,14.1 39.31,14.16 U1.1 38.54,14.16
  Bottom 0.203: 21.08,1.78 21.84,2.54 24.51,2.54 25.02,3.05 26.92,3.05 27.43,3.56 29.34,3.56 31.75,5.97 34.8,5.97 38.23,9.4 38.23,11.81 v37.59,12.45
  Bottom 1.016: CON1.8 21.08,1.78
N$14  (via drill 0.4)
  Top 0.203: v38.61,12.57 37.97,13.21 37.97,14.48 38.15,14.66 U1.2
  Bottom 0.203: 23.88,1.27 25.15,2.54 27.05,2.54 27.56,3.05 29.46,3.05 31.95,5.54 35.13,5.54 38.73,9.14 38.73,12.45 v38.61,12.57
  Bottom 1.016: CON1.9 23.88,1.27
N$15  (via drill 0.4)
  Top 0.203: v37.21,13.84 37.21,14.35 38.02,15.16 U1.3
  Bottom 0.203: 26.42,1.27 27.69,2.54 29.59,2.54 32.13,5.08 35.43,5.08 39.37,9.02 39.37,12.83 38.35,13.84 v37.21,13.84
  Bottom 1.016: CON1.10 26.42,1.27
N$16
  Top 0.254: U1.56 32.77,11.18 32.38,10.79 32.26,10.79
  Top 0.508: C2.1 31.11,10.79 32.26,10.79
  Top 1.016: C9.1 C2.1
N$17
  Top 0.203: U1.39 26.02,18.66 24.94,17.58 24.94,16.94 24.38,16.38
  Top 0.508: Q1.2 20.19,17.02 20.83,16.38 C7.2 24.38,16.38
N$18  (via drill 0.4)
  Top 0.203: v36.2,13.21 35.94,12.95 34.54,12.95 34.27,12.68 U1.59
  Bottom 0.203: v36.2,13.21 36.2,13.97 36.83,14.61 38.23,14.61 39.88,12.95 39.88,8.76 35.74,4.62 32.31,4.62 28.96,1.27
  Bottom 1.016: CON1.11 28.96,1.27
N$19
  Top 0.203: U1.40 26.16,18.16 25.42,17.42 25.42,16.4 24.38,15.37
  Top 0.508: Q1.1 20.19,15.37 23.11,15.37 C8.2 23.88,14.86 24.38,15.37
N$21  (via drill 0.4)
  Top 0.203: 28.23,15.66 28.32,15.75 30.48,15.75 31.62,16.89 32.89,16.89 34.29,15.49 35.81,15.49 v36.07,15.24
  Top 0.254: 28.23,15.66 U1.45
  Bottom 0.203: 33.27,1.91 33.27,2.79 34.29,3.81 36.45,3.81 41.78,9.14 41.78,12.95 42.04,13.21 42.04,14.1 41.53,14.61 38.86,14.61 38.23,15.24 v36.07,15.24
  Bottom 1.016: CON1.13 33.27,1.91
N$22  (via drill 0.4)
  Top 0.203: 27.82,17.16 27.94,17.27 30.1,17.27 31.24,18.41 35.18,18.41 36.45,17.14 36.45,16.38 v36.83,16
  Top 0.254: 27.82,17.16 U1.42
  Bottom 0.203: 36.58,1.27 38.48,3.17 39.5,3.17 42.29,5.97 42.29,12.7 42.55,12.95 42.55,14.35 41.78,15.11 38.99,15.11 38.1,16 v36.83,16
  Bottom 1.016: CON1.14 36.58,1.27
N$23
  Top 0.508: R9.1 24.26,4.19 LED1.A
N$24  (via drill 0.4)
  Top 0.203: v35.31,13.72 34.54,14.48 33.91,14.48 32.27,12.84 U1.55
  Bottom 0.203: v35.31,13.72 35.31,15.75 36.32,16.76 38.1,16.76 39.24,15.62 42.04,15.62 43.05,14.61 43.05,12.83 42.8,12.57 42.8,5.71 39.12,2.03
  Bottom 1.27: CON1.15 39.12,2.03
N$25  (via drill 0.4)
  Top 0.203: v32.13,13.72 31.77,13.36 U1.54 | 3.56,31.75 4.83,30.48 6.73,30.48 7.24,29.97 8.76,29.97 v9.91,28.83
  Top 1.016: CON2.1 3.56,31.75
  Bottom 0.203: v32.13,13.72 32.13,13.84 31.11,14.86 31.11,19.3 26.04,24.38 24.89,24.38 24.26,25.02 21.97,25.02 20.95,26.04 20.95,28.96 20.32,29.59 19.68,29.59 19.18,30.1 17.53,30.1 17.27,29.84 12.06,29.84 11.81,29.59 10.67,29.59 v9.91,28.83
N$26  (via drill 0.4)
  Top 0.203: v30.99,13.97 31.27,13.69 U1.53 | v11.05,28.83 9.4,30.48 7.37,30.48 6.1,31.75
  Top 1.016: CON2.2 6.1,31.75
  Bottom 0.203: v30.99,13.97 30.99,14.22 30.61,14.61 30.61,19.18 25.91,23.88 24.64,23.88 24,24.51 21.84,24.51 20.45,25.91 20.45,28.7 20.07,29.08 19.43,29.08 18.92,29.59 17.78,29.59 17.53,29.34 12.32,29.34 11.81,28.83 v11.05,28.83
N$27
  Top 0.203: R4.1 R3.2
  Top 0.406: VR(3.3V).1 41.32,3.28 42.62,4.57 45.21,4.57 46.1,3.68 R4.1
  Top 0.508: R4.1 R3.2
N$28  (via drill 0.4)
  Top 0.254: U1.51 30.27,10.84 29.84,10.41 28.57,10.41 27.3,11.68 25.53,11.68 v25.4,11.81
  Bottom 0.203: 9.65,31.75 8.13,30.23 8.13,24.26 19.81,12.57 24.64,12.57 v25.4,11.81
  Bottom 1.016: 9.65,31.75 CON2.4
N$29  (via drill 0.4)
  Top 0.254: U1.50 29.77,11.1 29.59,10.92 28.96,10.92 27.3,12.57 v26.16,12.57
  Bottom 0.203: 12.19,31.75 11.05,30.61 9.4,30.61 8.64,29.84 8.64,24.51 20.07,13.08 24.89,13.08 25.4,12.57 v26.16,12.57
  Bottom 1.016: 12.19,31.75 CON2.5
N$30
  Top 0.508: L2_E.1 R10.2
N$31  (via drill 0.4)
  Top 0.203: v30.35,22.61 30.35,22.73 30.77,23.15 U1.29
  Bottom 0.203: v30.35,22.61 30.35,23.37 28.19,25.53 26.8,25.53 21.72,30.61 19.94,30.61 18.8,31.75
  Bottom 1.016: CON2.7 18.8,31.75
N$32  (via drill 0.4)
  Top 0.203: v31.37,22.61 31.37,22.73 31.77,23.13 U1.27
  Bottom 0.203: v31.37,22.61 31.37,22.99 28.35,26.01 26.95,26.01 21.21,31.75
  Bottom 1.016: CON2.8 21.21,31.75
N$33  (via drill 0.4)
  Top 0.203: v32.38,22.61 32.77,22.61 33.27,23.11 U1.24
  Bottom 0.203: v32.38,22.61 28.55,26.44 27.15,26.44 23.11,30.48 23.11,31.11
  Bottom 1.016: 23.11,31.11 CON2.9
N$34  (via drill 0.4)
  Top 0.203: U1.23 33.77,22.98 32.51,21.72 v31.88,21.72
  Bottom 0.203: v31.88,21.72 32.51,21.72 33.15,22.35 33.15,22.86 32.64,23.37 32.38,23.37 28.88,26.87 27.36,26.87 25.65,28.57 25.65,30.23
  Bottom 1.016: 25.65,30.23 CON2.10
N$35  (via drill 0.4)
  Top 0.203: v33.78,21.97 34.27,22.46 U1.22
  Bottom 0.203: v33.78,21.97 33.78,22.99 32.89,23.88 32.51,23.88 29.11,27.28 27.58,27.28 26.92,27.94 26.92,30.48 27.18,30.73
  Bottom 1.016: 27.18,30.73 CON2.11
N$36  (via drill 0.4)
  Top 0.203: v34.42,21.08 34.77,21.43 U1.21
  Bottom 0.203: v34.42,21.08 34.54,21.21 34.54,22.86 33.02,24.38 32.64,24.38 29.34,27.69 27.81,27.69 27.43,28.07 27.43,28.96 30.23,31.75
  Bottom 1.016: 30.23,31.75 CON2.12
N$37  (via drill 0.4)
  Top 0.203: U1.12 39.78,19.66 40.01,19.88 40.01,21.08 v40.26,21.34
  Top 0.508: v31.75,29.21 31.75,29.59 32.26,30.1 32.26,30.73 32.89,31.37
  Top 1.016: 32.89,31.37 CON2.13
  Bottom 0.203: v40.26,21.34 37.59,21.34 36.7,20.45 36.2,20.45 35.05,21.59 35.05,22.99 32.89,25.15 32.89,26.92 33.91,27.94 34.67,27.94 35.05,28.32 35.05,29.21 34.8,29.46 32,29.46 v31.75,29.21
N$38
  Top 0.203: 52.35,25.98 51.77,25.4 46.61,25.4 45.72,24.51 R2.2
  Top 1.016: 52.35,25.98 ICSP.1
N$39  (via drill 0.4)
  Top 0.203: U1.13 37.5,20.16 v36.45,21.21
  Top 0.762: v36.96,29.46 36.96,30.61 CON2.14
  Bottom 0.203: v36.96,29.46 34.92,27.43 34.04,27.43 33.4,26.8 33.4,25.27 35.56,23.11 35.56,22.1 v36.45,21.21
N$40  (via drill 0.4)
  Top 0.203: v39.75,28.42 39.62,28.55 39.62,30.48 38.86,31.24 | U1.14 38.02,20.66 37.47,21.21 37.47,21.97 38.1,22.61 38.86,22.61 40.26,24 v40.26,25.02
  Top 1.016: 38.86,31.24 CON2.15
  Bottom 0.203: v40.26,25.02 40.26,27.91 v39.75,28.42
N$41  (via drill 0.4)
  Top 0.203: U1.15 38.15,21.16 37.97,21.34 37.97,21.84 38.23,22.1 38.99,22.1 41.15,24.26 v41.15,25.78 | v40.39,29.21 40.39,31.24
  Top 1.016: 40.39,31.24 CON2.16
  Bottom 0.203: v41.15,25.78 41.15,28.45 v40.39,29.21
N$42  (via drill 0.4)
  Top 0.203: v31.88,15.24 31.24,15.24 30.23,14.22 30.23,13.59 30.77,13.04 U1.52 | v16.76,30.61 16.64,30.48 15.11,30.48 14.86,30.73 13.72,30.73 13.59,30.61 9.91,30.61 8.76,31.75 8.64,31.75
  Top 0.508: v25.15,25.15 25.91,25.15 BUT_J.2
  Top 1.016: CON2.3 8.64,31.75
  Bottom 0.203: v31.88,15.24 31.62,15.49 31.62,19.43 25.91,25.15 v25.15,25.15 24.77,25.53 22.1,25.53 21.46,26.16 21.46,29.21 20.57,30.1 19.81,30.1 19.3,30.61 v16.76,30.61
N$44  (via drill 0.4)
  Top 0.254: 41.27,17.66 v41.27,18.03 | 41.27,17.66 U1.8 | v41.27,13.59 41.27,17.66
  Bottom 0.203: 31.24,1.78 33.68,4.22 36.09,4.22 41.27,9.4 v41.27,13.59
  Bottom 0.254: v41.27,18.03 41.4,18.16 44.7,18.16 44.96,18.41 44.96,18.8 G9/F0.3
  Bottom 1.016: CON1.12 31.24,1.78
N$45  (via drill 0.4)
  Top 0.203: v34.29,13.72 33.77,13.2 U1.58
  Bottom 0.203: G9/F0.1 42.67,18.8 40.13,18.8 39.75,18.41 34.8,18.41 33.66,17.27 33.66,15.49 34.29,14.86 v34.29,13.72
  Bottom 0.254: G9/F0.1 44.07,19.05
N$115
  Top 0.508: U4.3 17.3,5.84 R1.2
N$116
  Top 0.762: C10.1 15.75,25.15 14.86,24.26 7.49,24.26 6.82,23.58 MICRO_SD.4
  Top 1.016: L1.2 18.16,25.15 C10.1
N$137  (via drill 0.4)
  Top 0.254: v19.18,8.76 19.18,9.02 18.29,9.91 18.29,11.05 17.4,11.94
  Top 0.508: 13.97,6.35 14.42,6.8 U4.1 14.13,7.11 13.84,7.11 v13.72,6.99 | R21.2 16.76,11.94 17.4,11.94
  Top 1.27: 13.97,6.35 C17.1 L3.2
  Bottom 0.254: v13.72,6.99 13.72,8.26 14.61,9.14 18.8,9.14 v19.18,8.76
PGEC2  (via drill 0.4)
  Top 0.203: U1.17 36.77,24.95 v36.58,25.15
  Bottom 0.203: v36.58,25.15 38.99,22.73 43.31,22.73 47.35,26.78 ICSP.5
PGED2  (via drill 0.4)
  Top 0.203: U1.18 36.27,22.79 v36.32,22.73
  Bottom 0.203: v36.32,22.73 36.83,22.23 43.43,22.23 48.6,27.39 ICSP.4
RESET
  Top 0.203: 42.55,26.29 43.38,26.29 D2.A | 42.55,26.29 42.55,25.02 R2.1 | 41.66,26.54 R16.2 | U1.7 38.22,17.16 37.97,17.4 37.97,17.65 35.69,19.94 35.69,21.46 36.2,21.97 36.83,21.97 37.72,22.86 37.72,23.66 RST.1 38.35,25.78 | 38.35,25.78 39.62,25.78 40.39,26.54 41.66,26.54 | 41.66,26.54 42.55,26.54 42.55,26.29 | C21.1 35.61,27.25 36.37,27.25 36.7,26.92 36.7,26.29 37.21,25.78 38.35,25.78
RXD  (via drill 0.4)
  Top 0.203: U1.31 29.77,23.17 29.46,22.86 29.46,22.1 30.61,20.95 v33.4,20.95
  Bottom 0.203: 50.29,19.05 49.02,20.32 47.24,20.32 46.99,20.57 46.99,21.46 46.23,22.23 44.07,22.23 43.56,21.72 41.66,21.72 40.51,20.57 37.47,20.57 36.83,19.94 34.42,19.94 v33.4,20.95
  Bottom 1.016: 50.29,19.05 UEXT.4
SCK/LED1  (via drill 0.4)
  Top 0.203: v46.23,9.4 45.59,10.03 41.27,10.03 40.01,11.3 40.01,15.37 39.72,15.66 U1.4 37.88,15.66 36.58,14.35 35.81,14.35 35.18,14.99 33.15,14.99 v32.77,14.61
  Top 0.254: v23.75,11.81 v23.75,7.87
  Top 0.508: v23.75,7.87 L1_E.2 | MICRO_SD.5 4.3,24.64 v6.35,24.64
  Bottom 0.203: v23.75,11.81 23.5,12.06 19.56,12.06 6.99,24.64 v6.35,24.64 | v23.75,7.87 24,8.13 27.69,8.13 32.89,13.34 32.89,14.48 v32.77,14.61
  Bottom 1.016: v46.23,9.4 UEXT.9
SCL  (via drill 0.4)
  Top 0.203: R11.1 44.96,18.16 46.61,18.16 | 28.09,16.16 28.19,16.26 30.35,16.26 31.5,17.4 33.53,17.4 v34.42,16.51
  Top 0.254: U1.44 28.09,16.16
  Top 1.016: UEXT.5 46.61,18.16
  Bottom 0.203: v34.42,16.51 34.42,17.4 34.92,17.91 40.39,17.91 41.02,17.27 41.66,17.27 42.04,17.65 46.23,17.65 47.37,16.51
  Bottom 1.016: 47.37,16.51 UEXT.5
SDA  (via drill 0.4)
  Top 0.203: 46.1,15.24 49.53,15.24 | 27.96,16.66 28.07,16.76 30.23,16.76 31.37,17.91 34.54,17.91 v35.31,17.14
  Top 0.254: U1.43 27.96,16.66
  Top 0.508: R12.1 44.32,16.76 44.58,16.76 v45.34,16 46.1,15.24
  Top 1.016: 49.53,15.24 UEXT.6
  Bottom 0.203: v35.31,17.14 35.56,17.4 38.23,17.4 39.5,16.13 42.04,16.13 42.55,16.64 44.7,16.64 v45.34,16
TXD  (via drill 0.4)
  Top 0.203: U1.32 29.27,23.43 28.83,22.99 28.83,22.1 30.73,20.19 v32.64,20.19
  Bottom 0.203: v32.64,20.19 33.4,19.43 36.96,19.43 37.59,20.07 40.64,20.07 41.78,21.21 43.81,21.21 44.32,21.72 45.97,21.72 46.48,21.21 46.48,20.32 47.75,19.05
  Bottom 1.016: 47.75,19.05 UEXT.3
UEXT_#CS
  Top 0.203: 46.74,12.7 49.53,12.7
  Top 0.508: 46.74,12.7 44.83,14.61 R13.1
  Top 1.016: 49.53,12.7 UEXT.10
  Bottom 0.254: 51.56,12.19 52.07,12.7 52.07,17.02 51.31,17.78 47.5,17.78 46.35,18.92 46.35,19.43 45.85,19.94 44.7,19.94 44.32,19.56 44.32,19.3 G9/F0.2
  Bottom 1.016: UEXT.10 51.56,12.19
USB_FAULT  (via drill 0.4)
  Top 0.203: U1.30 30.27,24.72 30.1,24.89 28.96,24.89 28.7,24.64 28.7,23.75 27.94,22.99 24.89,22.99 v24.51,22.61 | 14.22,16.89 17.27,19.94
  Top 0.254: v17.65,23.5 17.91,23.24 17.91,21.34 17.27,20.7 17.27,19.94 | R18.2 16.76,15.11 14.35,15.11 14.22,15.24 14.22,16.89
  Top 0.508: R18.2 R21.1
  Bottom 0.203: v17.65,23.5 23.62,23.5 v24.51,22.61
USB_ID  (via drill 0.4)
  Top 0.203: v28.57,18.03 29.46,18.92 29.46,19.94 27.75,21.66
  Top 0.254: v4.06,8.26 4.32,8 5.71,8 5.93,8.22 | 27.75,21.66 U1.33
  Top 0.406: 5.93,8.22 USB.ID
  Bottom 0.203: v4.06,8.26 4.57,7.75 5.97,7.75 6.6,8.38 12.95,8.38 14.22,9.65 27.3,9.65 28.7,11.05 28.7,17.91 v28.57,18.03
USB_SHIELD
  Top 0.762: USB.GND2 USB.GND1 USB.GND3 USB.GND4
  Top 1.27: USB.GND4 7.18,3.68 10.29,3.68 L4.2
VBUSON  (via drill 0.4)
  Top 0.203: v37.85,19.18 37.83,19.16 U1.11
  Top 0.254: 18.67,6.48 18.54,6.48 16.51,8.51
  Top 0.508: U4.4 16.32,8.7 16.51,8.51 | 18.67,6.48 19.18,5.97 R15.2 19.43,5.59 20.07,5.59 v20.19,5.46
  Bottom 0.203: v37.85,19.18 37.59,18.92 34.67,18.92 33.15,17.4 33.15,15.37 33.53,14.99 33.53,13.34 27.81,7.62 24.64,7.62 24.13,7.11 22.63,7.11 21.11,5.59 20.32,5.59 v20.19,5.46
VCC  (via drill 0.4, 0.6)
  Top 0.203: 46.1,5.59 R4.2 | U1.26 32.27,24.63 31.88,25.02 31.88,25.65 C4.1 | 49.15,26.16 v48.64,26.16 | U1.10 39.74,18.66 40.44,19.36 40.44,20.12 41.27,20.95 41.91,20.95 C3.1 | 17.78,19.81 15.37,17.4 15.37,16.76
  Top 0.254: U1.35 25.82,20.66 25.74,20.57 24.51,20.57 24.51,19.18 24.77,18.92 25.65,18.92 25.89,19.16 U1.38 | L1.1 18.41,23.24 18.41,21.08 17.78,20.45 17.78,19.81 | U1.57 33.27,10.66 33.15,10.54 | C12.2 20.07,27.18 17.02,27.18 RM1.1.1
  Top 0.508: 21.84,25.65 20.83,25.65 20.83,26.42 C12.2 | 21.84,25.65 24.38,25.65 25.02,26.29 25.53,26.29 R17.1 26.92,27.69 27.43,27.69 v28.19,28.45 | v34.29,28.7 35.84,28.7 37.11,27.43 40.01,27.43 40.64,28.07 40.64,28.19 R16.1 | 21.84,25.65 21.84,22.73 22.86,21.72 23.37,21.72 C5.1 24.51,20.57 | 33.15,10.54 32.38,9.78 C14.1 | R6.2 15.37,16.26 15.37,16.76 | RM1.4.1 RM1.3.1 RM1.1.1
  Top 0.762: 46.1,5.59 v43.69,5.59 VR(3.3V).2 37.85,5.59 | 42.29,15.75 R12.2 R11.2 42.29,20.19 | 42.29,15.75 v43.05,15.75 v43.94,15.75 | 42.29,15.75 R13.2 42.29,12.06 L2.1 | 37.85,5.59 C1.1 | 37.85,5.59 VR(3.3V).4 33.91,5.59 33.91,8.25 32.63,9.53 C14.1 | CON2.17 D2.C 43.74,29.34 44.2,29.34 44.96,28.57 44.96,26.67 45.47,26.16 49.15,26.16 50.49,26.16 51.1,26.77 ICSP.2 | L1.1 20.83,25.65 | v30.48,27.69 30.48,26.54 31.11,25.91 C4.1 | 42.29,20.19 C3.1 | 46.48,19.81 45.21,19.81 44.83,20.19 42.29,20.19
  Top 1.016: R16.1 42.09,29.64 D2.C | UEXT.1 46.48,19.81 | v43.69,6.6 v43.69,5.59
  Bottom 0.762: v28.19,28.45 29.72,28.45 v30.48,27.69 31.88,27.69 32.89,28.7 v34.29,28.7 | v43.05,15.75 43.18,15.75
  Bottom 1.016: v48.64,26.16 48.64,21.97 UEXT.1 | 43.18,15.75 v43.94,15.75 43.94,12.45 43.69,12.19 v43.69,6.6 v43.69,5.59
  pour Top (isolate 0.305): 31.24,2.03 42.29,2.03 42.29,4.32 46.61,4.32 46.61,7.49 42.29,7.49 42.29,8.89 31.24,8.89
VDD  (via drill 0.4)
  Top 0.203: 35.77,25.65 C6.1 | v35.97,26.54 35.94,26.54 35.77,26.37 35.77,25.65 | 35.77,25.65 U1.19 | 43.56,23.5 41.66,23.5 J1.1
  Top 0.508: L2.2 45.72,12.06 49.4,8.38 v50.29,8.38 52.32,10.41 52.32,23.24 50.8,24.77 46.99,24.77 45.72,23.5 43.56,23.5 v42.93,23.5 | v49.66,3.3 C27.1
  Bottom 0.203: v42.93,23.5 39.37,23.5 36.32,26.54 v35.97,26.54
  Bottom 0.508: 48.39,3.3 48.39,6.48 v50.29,8.38 | 46.48,1.78 48.01,3.3 48.39,3.3 | 48.39,3.3 v49.66,3.3
  Bottom 1.016: CON1.18 46.48,1.78

### Text on the board
Top: Da se mahnata strelkite na LED1 i LED2 | 31 total errors | 28 errors
Bottom: 3 errors
tNames: 1 | 2 | 3 | 4 | 5 | 6 | 7 | 8 | 9 | 10 | 11 | 12 | 13 | 14 | 15 | 16 | 17 | 18 | 19 | 20 | 3.3V | 1 | 2 | 3 | 4 | 5 | 6 | 7 | 8 | 9 | 10 | 11 | 12 | 13 | 14 | 15 | 16 | 17 | 18 | 19 | 20
bNames: PIC32-PINGUINO-MICRO | (c) 2016 | Rev.C | MADE IN BULGARIA | https://www.olimex.com | 5VDC!!! | gnd
213bmp: POLIGONI NA CIFROVOTO ZAHRANVANE I CHARGERA